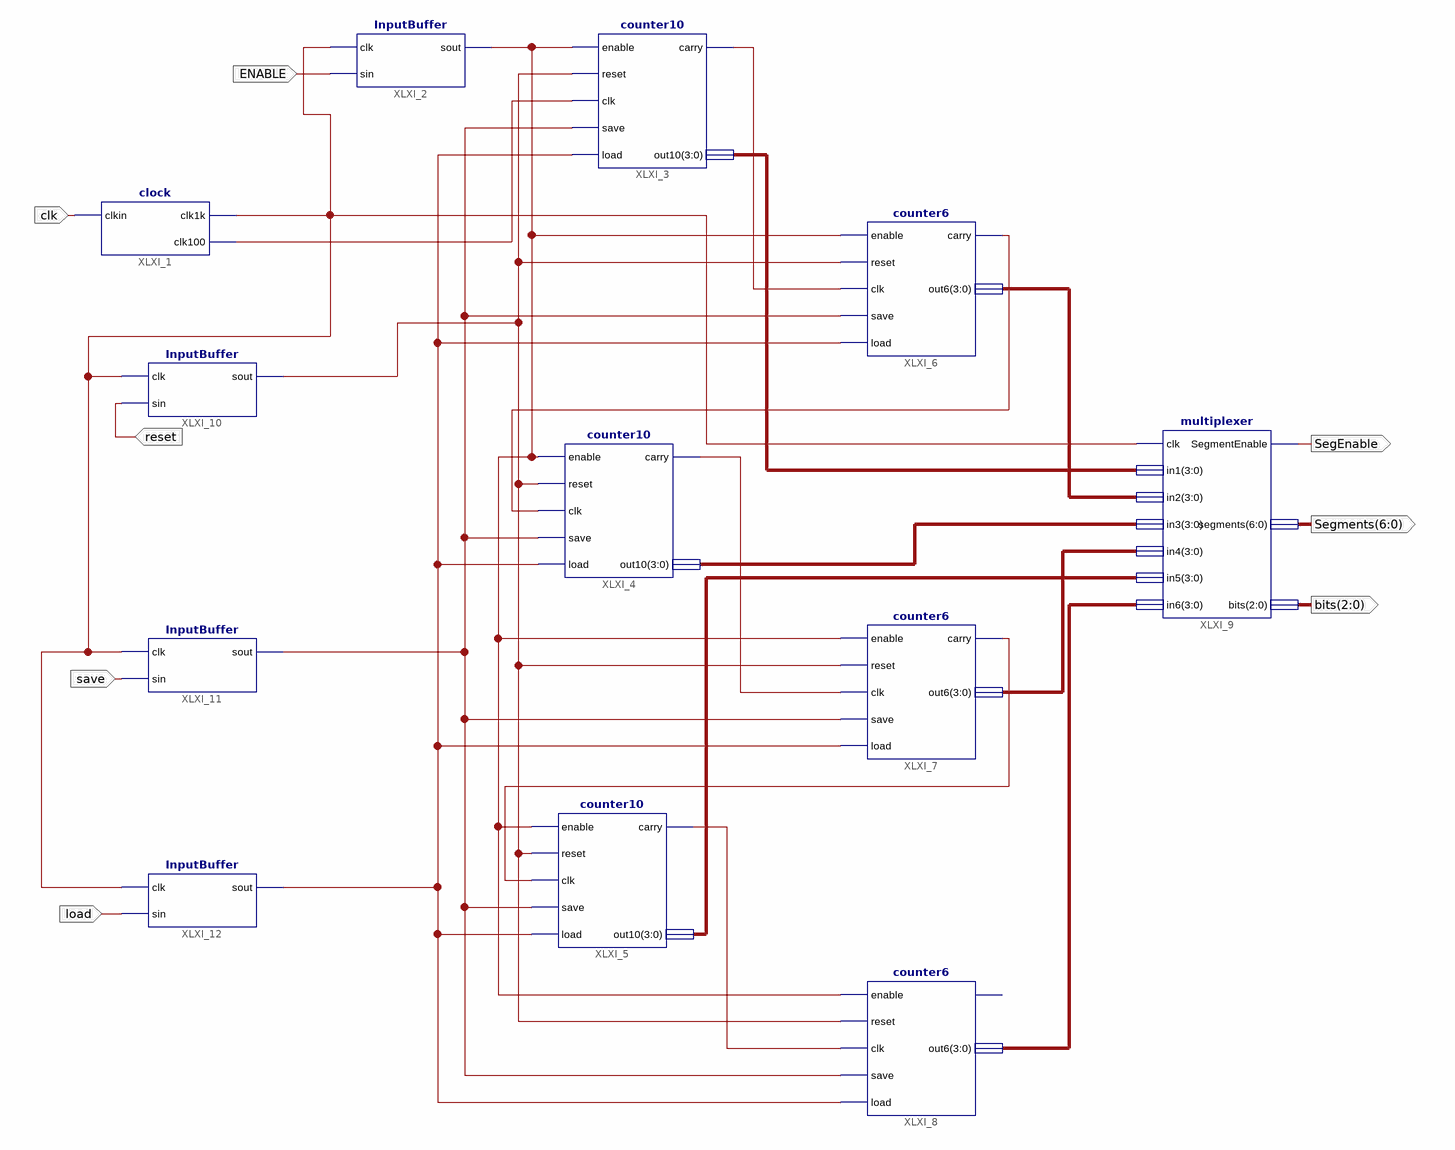
[diagram p0: schematic sheet 1]
// Xilinx ISE schematic SystemSchematic.sch (spartan3a) as structural Verilog: 12 symbols, 8 ports
module SystemSchematic (
  input  clk,
  input  ENABLE,
  input  reset,
  input  save,
  input  load,
  output SegEnable,
  output [6:0] Segments,
  output [2:0] bits
);

  wire XLXN_12, XLXN_13, XLXN_14, XLXN_19, XLXN_21, XLXN_22, XLXN_35, XLXN_42, XLXN_48, XLXN_54, XLXN_62;
  wire [3:0] XLXN_28, XLXN_29, XLXN_30, XLXN_31, XLXN_32, XLXN_33;

  clock XLXI_1 (.clkin(clk), .clk1k(XLXN_62), .clk100(XLXN_12));
  InputBuffer XLXI_2 (.clk(XLXN_62), .sin(ENABLE), .sout(XLXN_35));
  counter10 XLXI_3 (
    .enable(XLXN_35), .reset(XLXN_42), .clk(XLXN_12), .save(XLXN_48), .load(XLXN_54), .out10(XLXN_33),
    .carry(XLXN_13));
  counter10 XLXI_4 (
    .enable(XLXN_35), .reset(XLXN_42), .clk(XLXN_14), .save(XLXN_48), .load(XLXN_54), .out10(XLXN_31),
    .carry(XLXN_19));
  counter10 XLXI_5 (
    .enable(XLXN_35), .reset(XLXN_42), .clk(XLXN_21), .save(XLXN_48), .load(XLXN_54), .out10(XLXN_29),
    .carry(XLXN_22));
  counter6 XLXI_6 (
    .enable(XLXN_35), .reset(XLXN_42), .save(XLXN_48), .load(XLXN_54), .clk(XLXN_13), .out6(XLXN_32),
    .carry(XLXN_14));
  counter6 XLXI_7 (
    .enable(XLXN_35), .reset(XLXN_42), .save(XLXN_48), .load(XLXN_54), .clk(XLXN_19), .out6(XLXN_30),
    .carry(XLXN_21));
  counter6 XLXI_8 (
    .enable(XLXN_35), .reset(XLXN_42), .save(XLXN_48), .load(XLXN_54), .clk(XLXN_22), .out6(XLXN_28));  // open: carry
  multiplexer XLXI_9 (
    .clk(XLXN_62), .in1(XLXN_33), .in2(XLXN_32), .in3(XLXN_31), .in4(XLXN_30), .in5(XLXN_29), .in6(XLXN_28),
    .SegmentEnable(SegEnable), .segments(Segments), .bits(bits));
  InputBuffer XLXI_10 (.clk(XLXN_62), .sin(reset), .sout(XLXN_42));
  InputBuffer XLXI_11 (.clk(XLXN_62), .sin(save), .sout(XLXN_48));
  InputBuffer XLXI_12 (.clk(XLXN_62), .sin(load), .sout(XLXN_54));
endmodule
